# EasyEDA Pro project ProProject_AT32_FOC_2024-04-27.epro, board Bottom_board
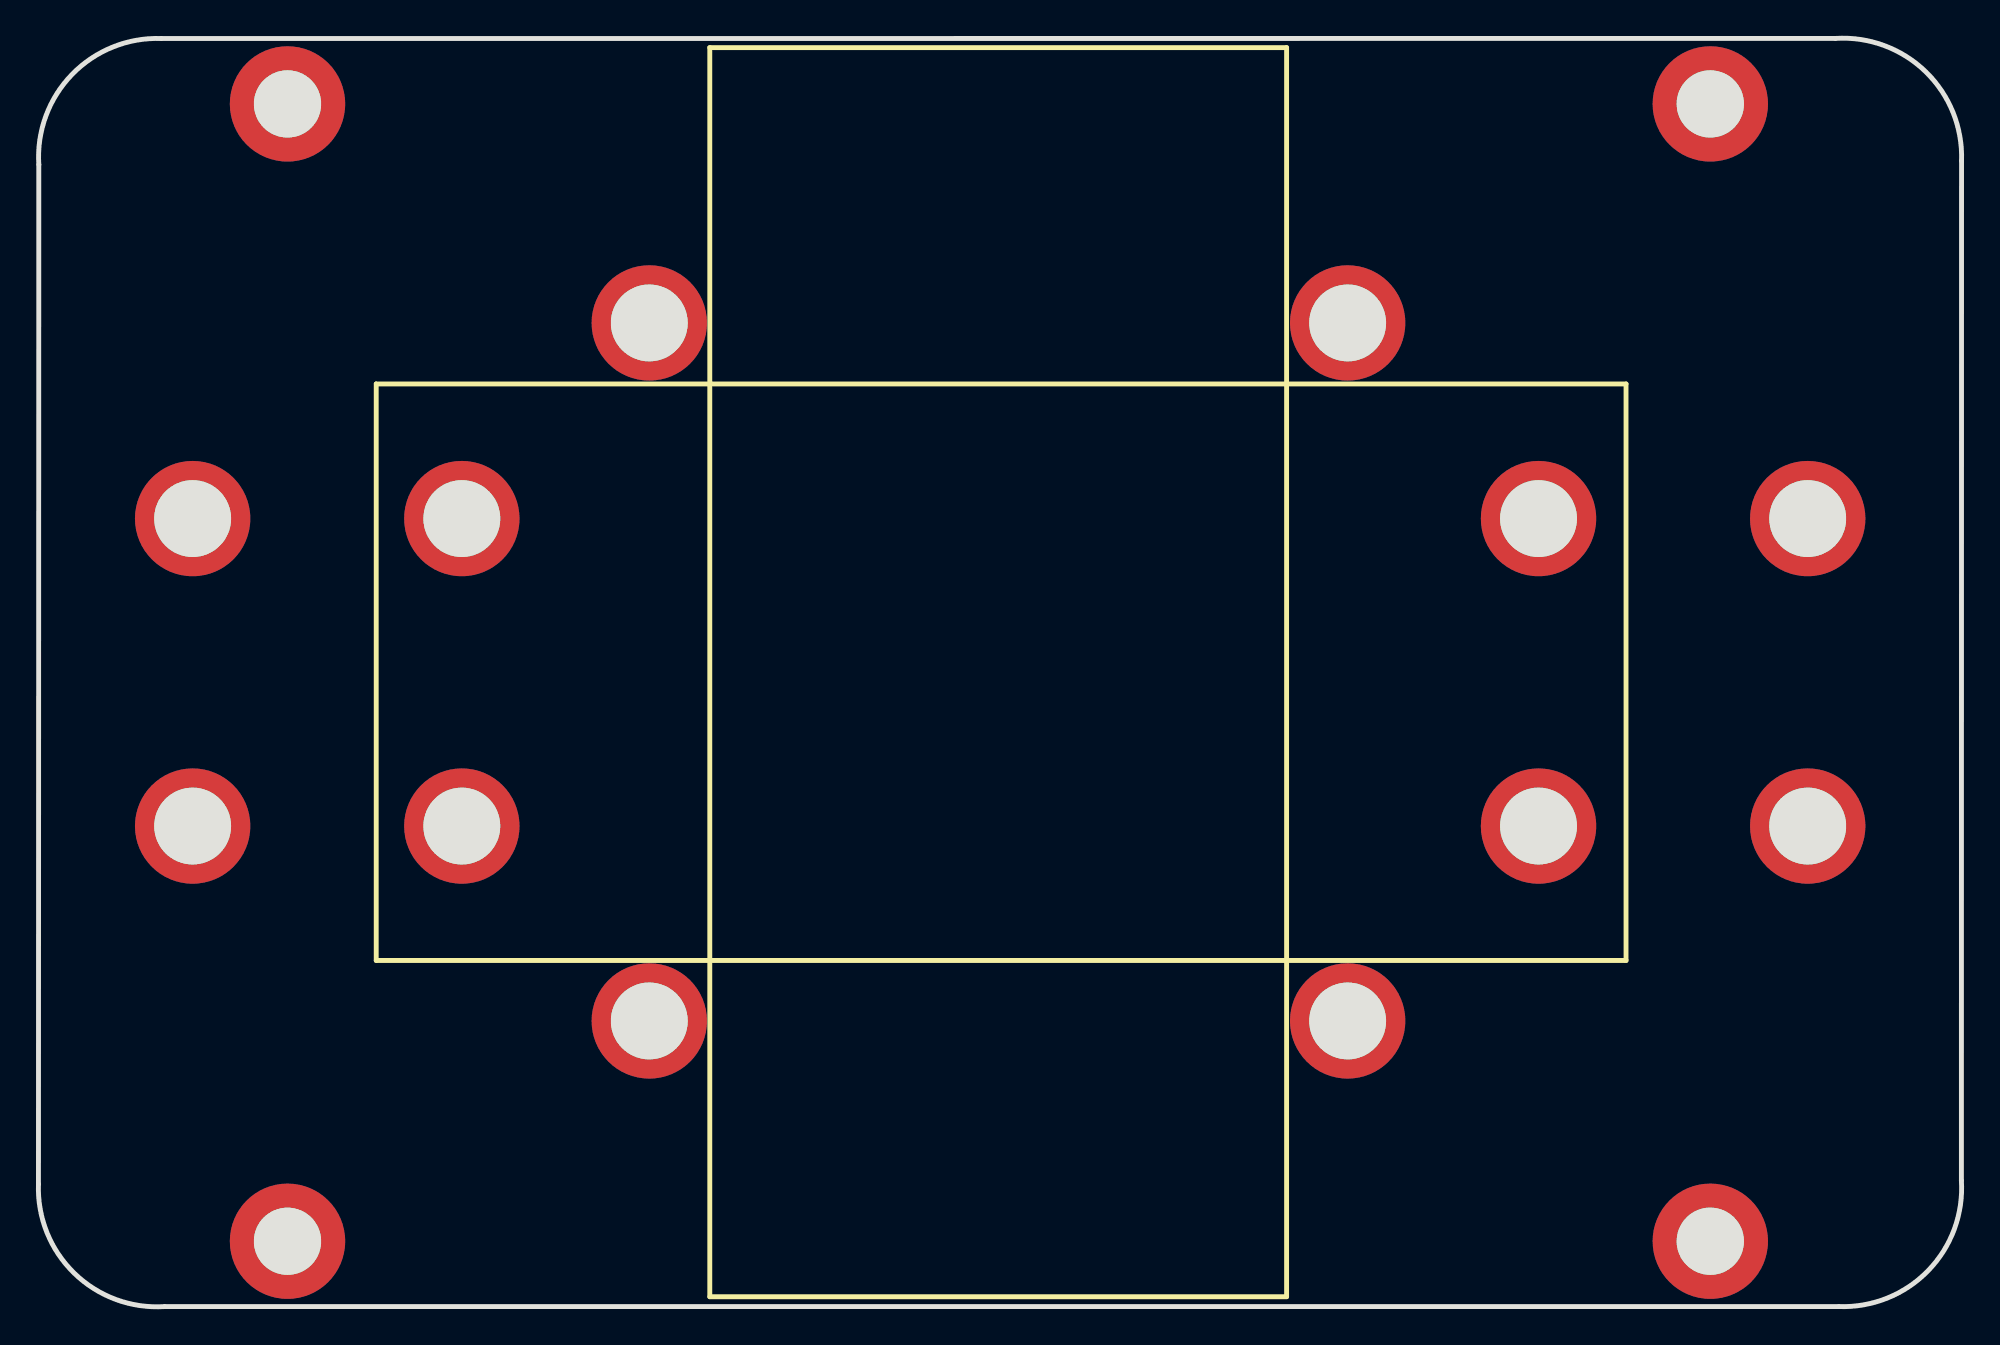
[diagram p2: board, top side]
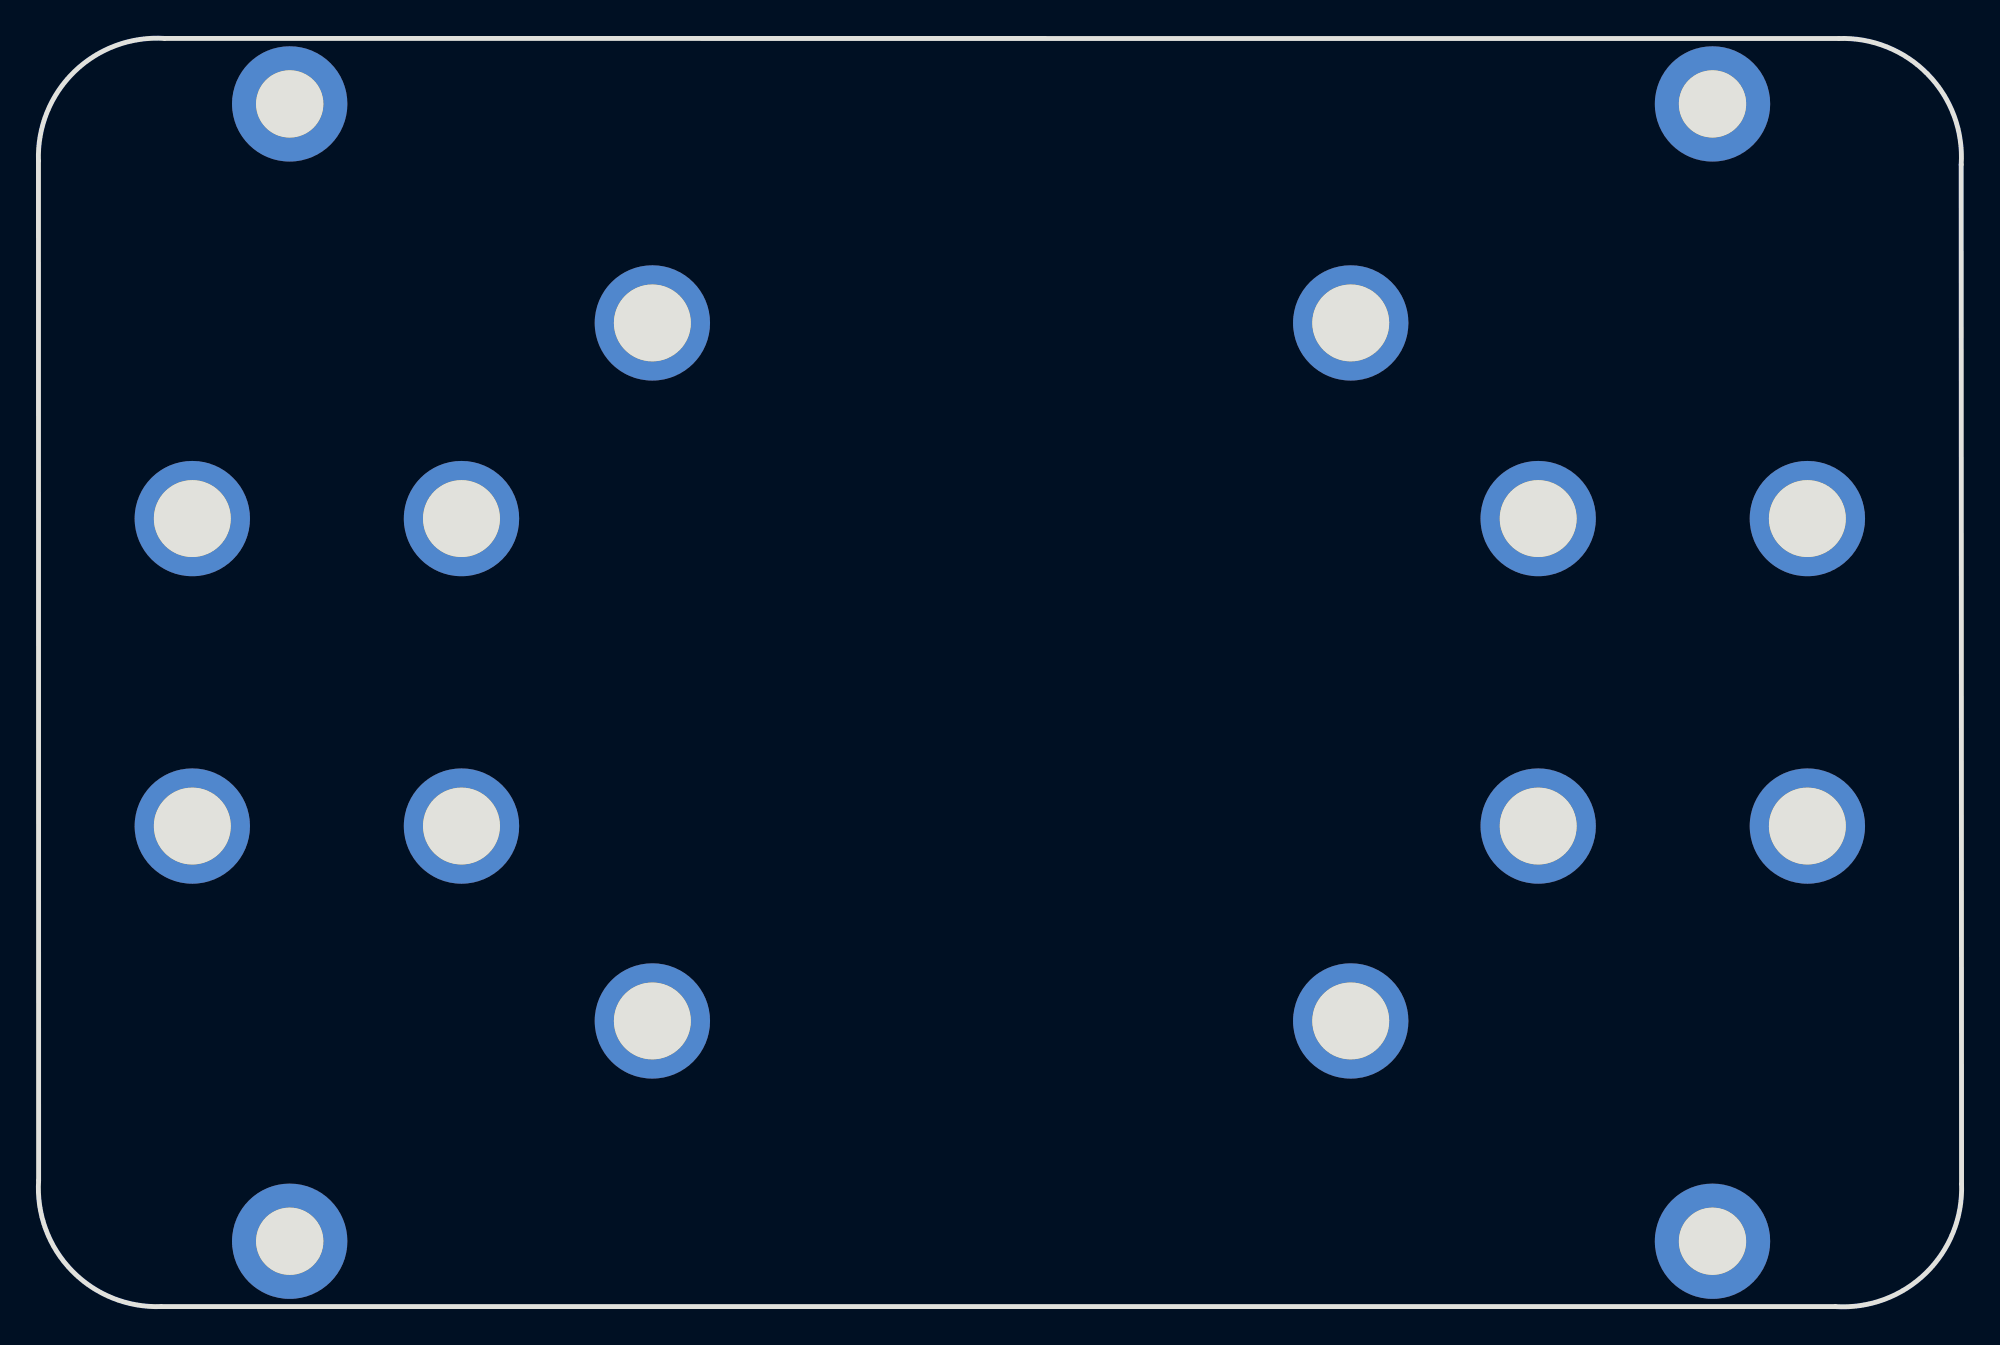
[diagram p3: board, bottom side, seen from below]

Outline 100.02 x 65.99 mm; copper layers: Top Layer, Bottom Layer. Coordinates in mm from the lower left corner of the outline.
Outline path: 0.02,59.42 0,6.37 arc(1.87,1.73) 6.56,0 93.64,0 arc(98.28,1.87) 100.01,6.56 100.02,59.62 arc(98.15,64.26) 93.46,65.99 6.39,65.98 arc(1.75,64.12) 0.02,59.42
Stack: Top Layer 0.035mm / Dielectric1 1.51mm FR4 er 4.5 / Bottom Layer 0.035mm

## Design rules (mm)
spacing Default (default): track to track 0.152, other pairs 0 to 0.152
track width Default (default): min 0.254, default 0.254, max 25.4
differential pair differentialPair (default): width min 0.127, default 0.254, max 2.54; gap min 0.152, default 0.152
via Default (default): diameter min 0.61, default 0.61, max 100.025; hole min 0.305, default 0.305, max 59.995

## Placement (name value [footprint] x y rotation side)
NOREF  -  [Pad_e59]  86.95 3.4 0 top
NOREF#2  -  [Pad_e57]  86.95 62.58 0 top
NOREF#3  -  [Pad_e49]  78.02 25 0 top
NOREF#4  -  [Pad_e61]  68.09 51.18 0 top
NOREF#5  -  [Pad_e48]  68.09 14.86 0 top
NOREF#6  -  [Pad_e36]  8.02 41 0 top
NOREF#7  -  [Pad_e60]  12.95 3.4 0 top
NOREF#8  -  [Pad_e62]  31.77 14.86 0 top
NOREF#9  -  [Pad_e63]  31.77 51.18 0 top
NOREF#10  -  [Pad_e39]  22.02 41 0 top
NOREF#11  -  [Pad_e58]  12.95 62.58 0 top
NOREF#12  -  [Pad_e50]  78.02 41 0 top
NOREF#13  -  [Pad_e52]  92.02 41 0 top
NOREF#14  -  [Pad_e53]  92.02 25 0 top
NOREF#15  -  [Pad_e38]  22.02 25 0 top
NOREF#16  -  [Pad_e35]  8.02 25 0 top

## Footprints (pads in the part's own frame, mm; a bottom-side part is the same pattern mirrored in y, then rotated)
Pad_e35
  round 6 hole 4: 1(0,0)
Pad_e36
  round 6 hole 4: 1(0,0)
Pad_e38
  round 6 hole 4: 1(0,0)
Pad_e39
  round 6 hole 4: 1(0,0)
Pad_e48
  round 6 hole 4: 1(0,0)
Pad_e49
  round 6 hole 4: 1(0,0)
Pad_e50
  round 6 hole 4: 1(0,0)
Pad_e52
  round 6 hole 4: 1(0,0)
Pad_e53
  round 6 hole 4: 1(0,0)
Pad_e57
  round 6 hole 3.5: 1(0,0)
Pad_e58
  round 6 hole 3.5: 1(0,0)
Pad_e59
  round 6 hole 3.5: 1(0,0)
Pad_e60
  round 6 hole 3.5: 1(0,0)
Pad_e61
  round 6 hole 4: 1(0,0)
Pad_e62
  round 6 hole 4: 1(0,0)
Pad_e63
  round 6 hole 4: 1(0,0)

## Nets

Pads without a net: NOREF 1; NOREF#2 1; NOREF#3 1; NOREF#4 1; NOREF#5 1; NOREF#6 1; NOREF#7 1; NOREF#8 1; NOREF#9 1; NOREF#10 1; NOREF#11 1; NOREF#12 1; NOREF#13 1; NOREF#14 1; NOREF#15 1; NOREF#16 1
